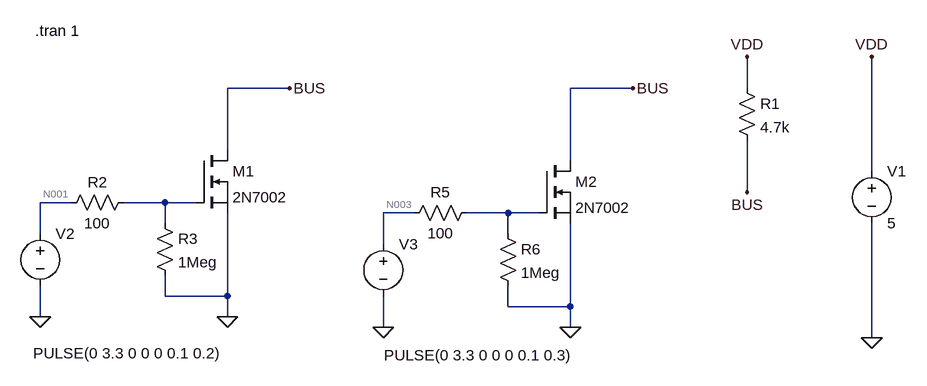
[diagram p0: schematic オープンドレインの例.asc]
オープンドレインの例.asc, the LTspice schematic file:
Version 4.1
SHEET 1 1592 680
WIRE 464 -112 368 -112
WIRE 992 -112 896 -112
WIRE 1168 -112 1168 -160
WIRE 368 -16 368 -112
WIRE 896 0 896 -112
WIRE 1360 16 1360 -160
WIRE 1168 48 1168 -32
WIRE 128 64 80 64
WIRE 272 64 208 64
WIRE 320 64 272 64
WIRE 656 80 608 80
WIRE 800 80 736 80
WIRE 848 80 800 80
WIRE 272 96 272 64
WIRE 80 112 80 64
WIRE 800 112 800 80
WIRE 608 128 608 80
WIRE 272 208 272 176
WIRE 368 208 368 80
WIRE 368 208 272 208
WIRE 800 224 800 192
WIRE 896 224 896 96
WIRE 896 224 800 224
WIRE 80 240 80 192
WIRE 368 240 368 208
WIRE 608 256 608 208
WIRE 896 256 896 224
WIRE 1360 272 1360 96
FLAG 80 240 0
FLAG 368 240 0
FLAG 1168 -160 VDD
FLAG 1360 272 0
FLAG 1360 -160 VDD
FLAG 464 -112 BUS
FLAG 608 256 0
FLAG 896 256 0
FLAG 992 -112 BUS
FLAG 1168 48 BUS
SYMBOL voltage 80 96 R0
WINDOW 3 -11 200 Left 2
WINDOW 123 0 0 Left 0
WINDOW 39 0 0 Left 0
SYMATTR InstName V2
SYMATTR Value PULSE(0 3.3 0 0 0 0.1 0.2)
SYMBOL res 1152 -128 R0
SYMATTR InstName R1
SYMATTR Value 4.7k
SYMBOL res 224 48 R90
WINDOW 0 0 56 VBottom 2
WINDOW 3 32 56 VTop 2
SYMATTR InstName R2
SYMATTR Value 100
SYMBOL nmos 320 -16 R0
SYMATTR InstName M1
SYMATTR Value 2N7002
SYMBOL voltage 1360 0 R0
WINDOW 123 0 0 Left 0
WINDOW 39 0 0 Left 0
SYMATTR InstName V1
SYMATTR Value 5
SYMBOL res 256 80 R0
SYMATTR InstName R3
SYMATTR Value 1Meg
SYMBOL voltage 608 112 R0
WINDOW 3 1 187 Left 2
WINDOW 123 0 0 Left 0
WINDOW 39 0 0 Left 0
SYMATTR InstName V3
SYMATTR Value PULSE(0 3.3 0 0 0 0.1 0.3)
SYMBOL res 752 64 R90
WINDOW 0 0 56 VBottom 2
WINDOW 3 32 56 VTop 2
SYMATTR InstName R5
SYMATTR Value 100
SYMBOL nmos 848 0 R0
SYMATTR InstName M2
SYMATTR Value 2N7002
SYMBOL res 784 96 R0
SYMATTR InstName R6
SYMATTR Value 1Meg
TEXT 72 -200 Left 2 !.tran 1

The netlist it stands for:
* オープンドレインの例.asc
V2 N001 0 PULSE(0 3.3 0 0 0 0.1 0.2)
R1 VDD BUS 4.7k
R2 N002 N001 100
M1 BUS N002 0 0 2N7002
V1 VDD 0 5
R3 N002 0 1Meg
V3 N003 0 PULSE(0 3.3 0 0 0 0.1 0.3)
R5 N004 N003 100
M2 BUS N004 0 0 2N7002
R6 N004 0 1Meg
.model NMOS NMOS
.model PMOS PMOS
.lib standard.mos
.tran 1
.backanno
.end

* Results of the author's LTspice run, read from the files saved beside the schematic
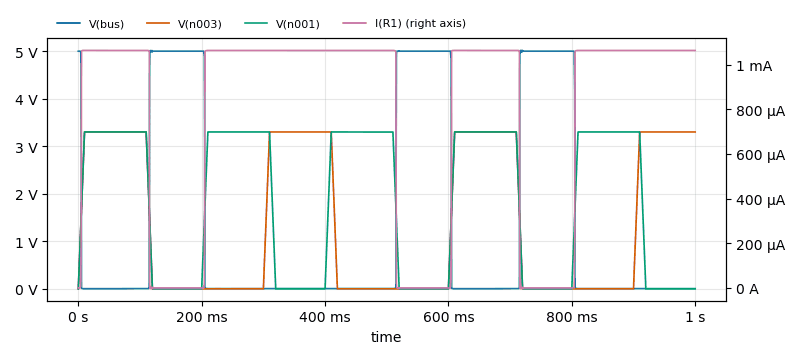
[diagram p1: Transient Analysis of オープンドレインの例.asc, plotted from the saved traces]
* Transient Analysis, 1 run:
*   V(bus): min 1.87 mV, max 5.017 V, average 1.369 V, rms 2.61 V, last 3.745 mV
*   V(n003): min 0 V, max 3.3 V, average 1.402 V, rms 2.122 V, last 3.3 V
*   V(n001): min 0 V, max 3.3 V, average 1.815 V, rms 2.41 V, last 0 V
*   I(R1): min -3.615 µA, max 1.063 mA, average 772.6 µA, rms 905.8 µA, last 1.063 mA